# EAGLE design STM32F1_Rev0.2 (EAGLE 6.4)
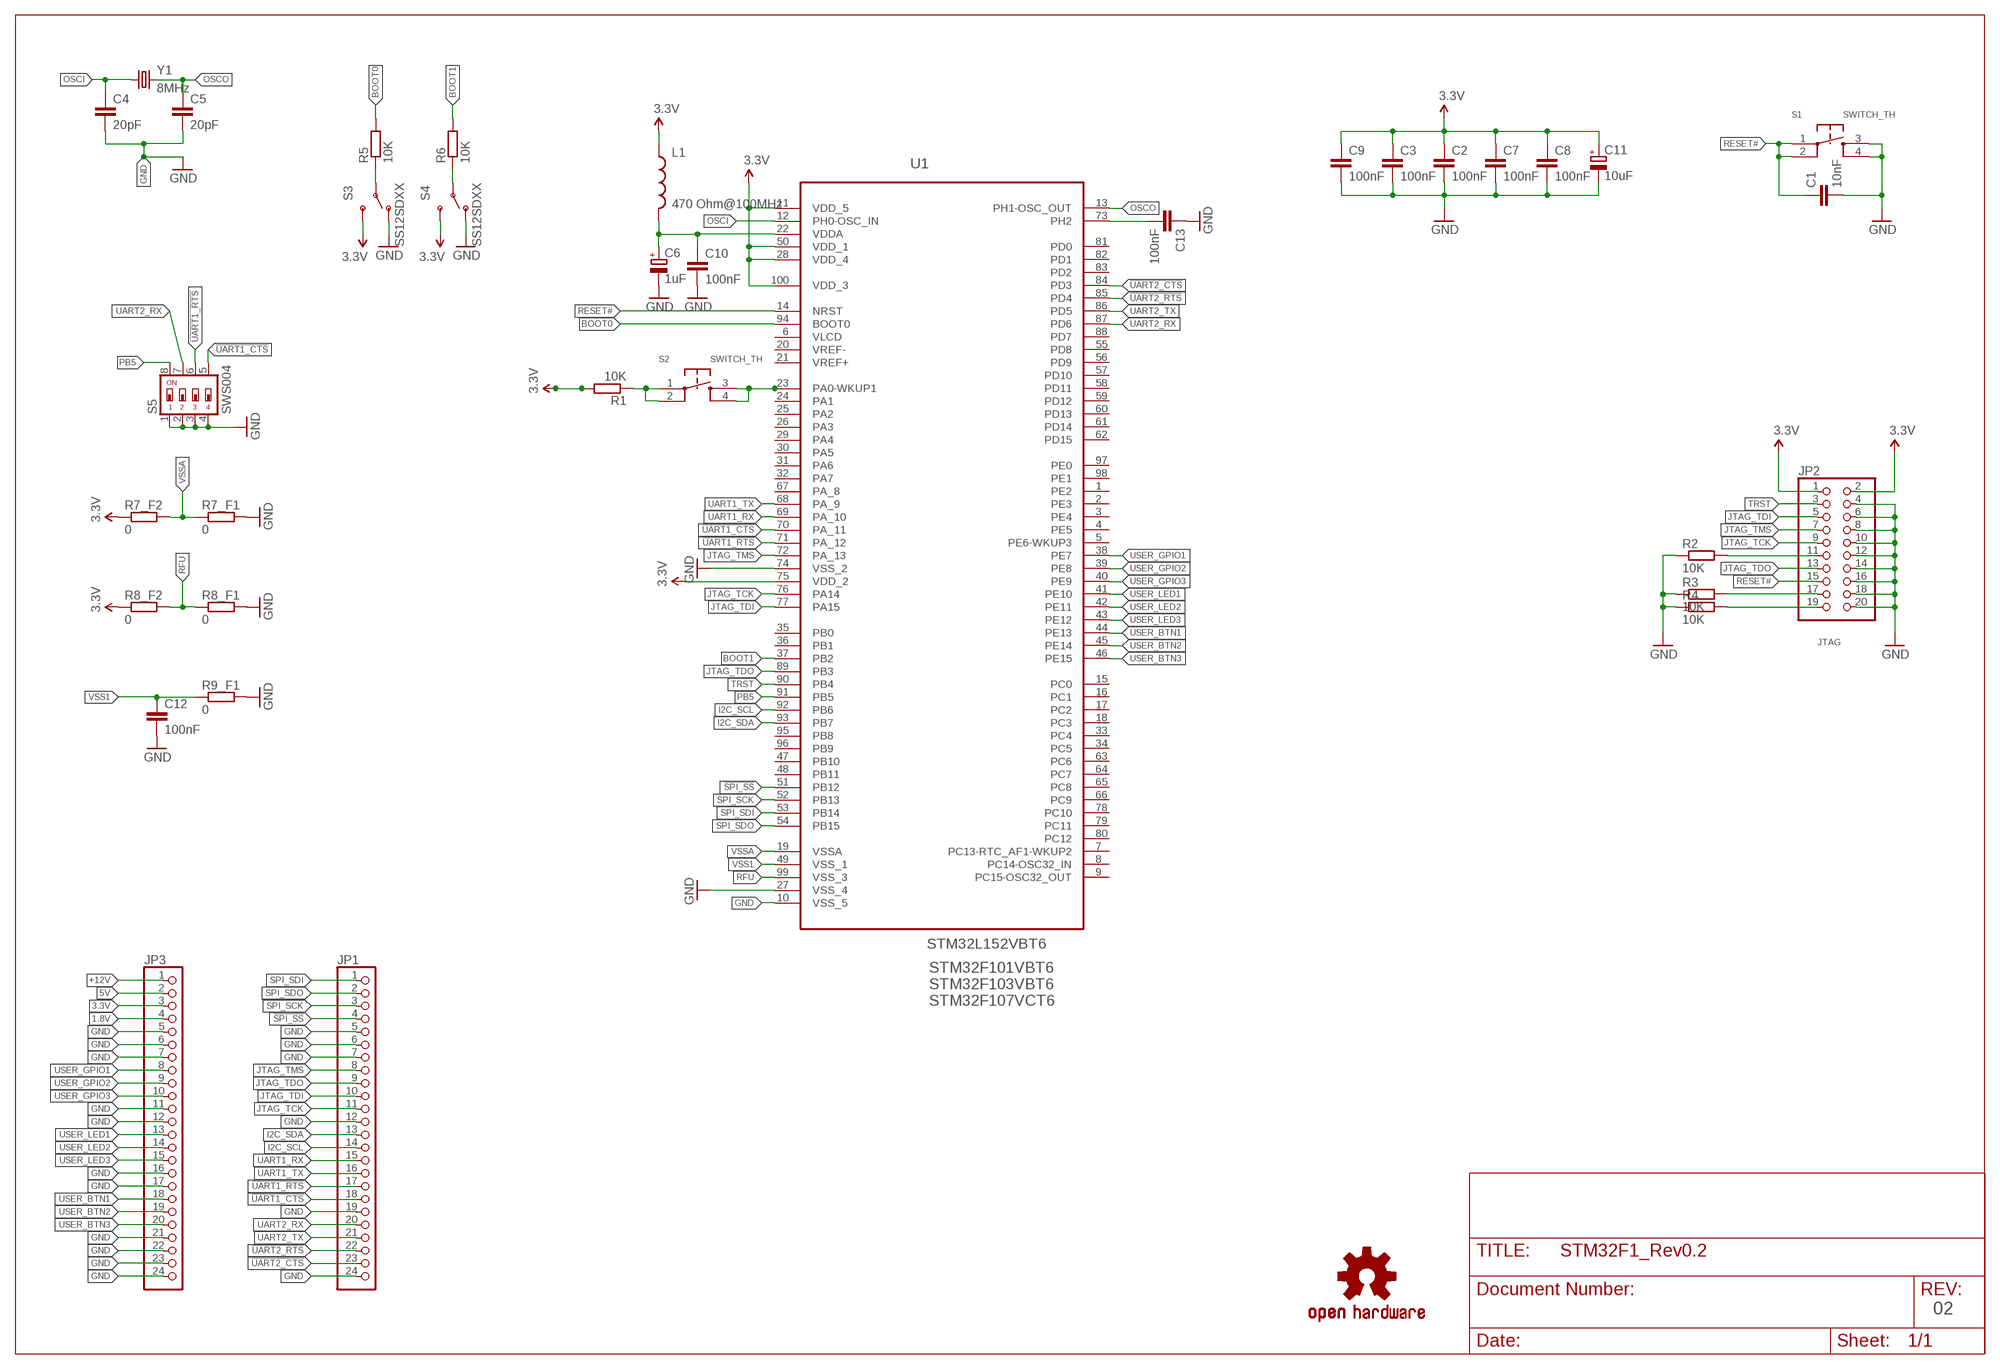
[diagram p0: schematic, sheet 1]

## Parts
C1  10nF  C-EUC0805K  [C0805K]
C2  100nF  C-EUC0805K  [C0805K]
C3  100nF  C-EUC0805K  [C0805K]
C4  20pF  C-EUC0805K  [C0805K]
C5  20pF  C-EUC0805K  [C0805K]
C6  1uF  CPOL-EUB  [PANASONIC_B]
C7  100nF  C-EUC0805K  [C0805K]
C8  100nF  C-EUC0805K  [C0805K]
C9  100nF  C-EUC0805K  [C0805K]
C10  100nF  C-EUC0805K  [C0805K]
C11  10uF  CPOL-EUB  [PANASONIC_B]
C12  100nF  C-EUC0805K  [C0805K]
C13  100nF  C-EUC0805K  [C0805K]
JP1  PINHD-1X24  [1X24]
JP2  PINHD-2X10  [2X10]
JP3  PINHD-1X24  [1X24]
L1  470 Ohm@100MHz  INDUCTOR0805  [0805]
R1  10K  R-EU_R0805  [R0805]
R2  10K  R-EU_R0805  [R0805]
R3  10K  R-EU_R0805  [R0805]
R4  10K  R-EU_R0805  [R0805]
R5  10K  R-EU_R0805  [R0805]
R6  10K  R-EU_R0805  [R0805]
R7_F1  0  R-EU_R0805  [R0805]
R7_F2  0  R-EU_R0805  [R0805]
R8_F1  0  R-EU_R0805  [R0805]
R8_F2  0  R-EU_R0805  [R0805]
R9_F1  0  R-EU_R0805  [R0805]
S1  SWITCH_TH  [SWITCH_TROUGHHOLE]
S2  SWITCH_TH  [SWITCH_TROUGHHOLE]
S3  SS12SDXX  [SS12SDXX]
S4  SS12SDXX  [SS12SDXX]
S5  SWS004  [SMS-004]
U1  STM32L152VBT6  [QFP50P1600X1600X160-100N]
U$1  OSHW-LOGOS  [OSHW-LOGO-S]
Y1  8MHz  CRYSTALSMD  [HC49UP]

## Nets
1.8V: JP3.4
3.3V: C2.1 C3.1 C7.1 C8.1 C9.1 C11.+ JP2.1 JP2.2 JP3.3 L1.1 R1.2 R7_F2.1 R8_F2.1 S3.3 S4.3 U1.11(VDD_5) U1.28(VDD_4) U1.50(VDD_1) U1.75(VDD_2) U1.100(VDD_3)
5V: JP3.2
!SPI_SS: JP1.4 U1.51(PB12)
!UART1_CTS: JP1.18 S5.5 U1.70(PA_11)
!UART1_RTS: JP1.17 S5.6 U1.71(PA_12)
!UART2_CTS: JP1.23 U1.84(PD3)
!UART2_RTS: JP1.22 U1.85(PD4)
+12V: JP3.1
BOOT0: R5.2 U1.94(BOOT0)
BOOT1: R6.2 U1.37(PB2)
GND: C1.2 C2.2 C3.2 C4.2 C5.2 C6.- C7.2 C8.2 C9.2 C10.2 C11.- C12.2 C13.1 JP1.5 JP1.6 JP1.7 JP1.12 JP1.19 JP1.24 JP2.4 JP2.6 JP2.8 JP2.10 JP2.12 JP2.14 JP2.16 JP2.18 JP2.20 JP3.5 JP3.6 JP3.7 JP3.11 JP3.12 JP3.16 JP3.17 JP3.21 JP3.22 JP3.23 JP3.24 R2.1 R3.1 R4.1 R7_F1.2 R8_F1.2 R9_F1.2 S1.3 S1.4 S3.1 S4.1 S5.1 S5.2 S5.3 S5.4 U1.10(VSS_5) U1.27(VSS_4) U1.74(VSS_2)
I2C_SCL: JP1.14 U1.92(PB6)
I2C_SDA: JP1.13 U1.93(PB7)
JTAG_TCK: JP1.11 JP2.9 U1.76(PA14)
JTAG_TDI: JP1.10 JP2.5 U1.77(PA15)
JTAG_TDO: JP1.9 JP2.13 U1.89(PB3)
JTAG_TMS: JP1.8 JP2.7 U1.72(PA_13)
N$1: C13.2 U1.73(PH2)
N$2: C6.+ C10.1 L1.2 U1.22(VDDA)
N$3: R1.1 S2.1 S2.2
N$6: R5.1 S3.2
N$7: R6.1 S4.2
N$18: JP2.11 R2.2
N$21: JP2.17 R3.2
N$22: JP2.19 R4.2
OSCI: C4.1 U1.12(PH0-OSC_IN) Y1.1
OSCO: C5.1 U1.13(PH1-OSC_OUT) Y1.2
PA0: S2.3 S2.4 U1.23(PA0-WKUP1)
PB5: S5.8 U1.91(PB5)
RESET#: C1.1 JP2.15 S1.1 S1.2 U1.14(NRST)
RFU: R8_F1.1 R8_F2.2 U1.99(VSS_3)
SPI_SCK: JP1.3 U1.52(PB13)
SPI_SDI: JP1.1 U1.53(PB14)
SPI_SDO: JP1.2 U1.54(PB15)
TRST: JP2.3 U1.90(PB4)
UART1_RX: JP1.15 U1.69(PA_10)
UART1_TX: JP1.16 U1.68(PA_9)
UART2_RX: JP1.20 S5.7 U1.87(PD6)
UART2_TX: JP1.21 U1.86(PD5)
USER_BTN1: JP3.18 U1.44(PE13)
USER_BTN2: JP3.19 U1.45(PE14)
USER_BTN3: JP3.20 U1.46(PE15)
USER_GPIO1: JP3.8 U1.38(PE7)
USER_GPIO2: JP3.9 U1.39(PE8)
USER_GPIO3: JP3.10 U1.40(PE9)
USER_LED1: JP3.13 U1.41(PE10)
USER_LED2: JP3.14 U1.42(PE11)
USER_LED3: JP3.15 U1.43(PE12)
VSS1: C12.1 R9_F1.1 U1.49(VSS_1)
VSSA: R7_F1.1 R7_F2.2 U1.19(VSSA)
Unconnected: U1.1(PE2) U1.2(PE3) U1.3(PE4) U1.4(PE5) U1.5(PE6-WKUP3) U1.7(PC13-RTC_AF1-WKUP2) U1.8(PC14-OSC32_IN) U1.9(PC15-OSC32_OUT) U1.15(PC0) U1.16(PC1) U1.17(PC2) U1.18(PC3) U1.20(VREF-) U1.21(VREF+) U1.24(PA1) U1.25(PA2) U1.26(PA3) U1.29(PA4) U1.30(PA5) U1.31(PA6) U1.32(PA7) U1.33(PC4) U1.34(PC5) U1.35(PB0) U1.36(PB1) U1.47(PB10) U1.48(PB11) U1.55(PD8) U1.56(PD9) U1.57(PD10) U1.58(PD11) U1.59(PD12) U1.60(PD13) U1.61(PD14) U1.62(PD15) U1.63(PC6) U1.64(PC7) U1.65(PC8) U1.66(PC9) U1.67(PA_8) U1.78(PC10) U1.79(PC11) U1.80(PC12) U1.81(PD0) U1.82(PD1) U1.83(PD2) U1.88(PD7) U1.95(PB8) U1.96(PB9) U1.97(PE0) U1.98(PE1)

## Notes on the sheet
- JTAG
- STM32F101VBT6
  STM32F103VBT6
  STM32F107VCT6
- 02

## Power pins joined to a net without a drawn wire
VLCD: U1.6(VLCD)

## Library data of the parts
C1-C5 C7-C10 C12 C13 = rcl:C-EU: CAPACITOR, European symbol
C6 C11 = rcl:CPOL-EU: POLARIZED CAPACITOR, European symbol
JP1 JP3 = pinhead:PINHD-1X24: PIN HEADER
JP2 = pinhead:PINHD-2X10: PIN HEADER
L1 = SparkFun:INDUCTOR: Inductors Basic Inductor/Choke - 0603 and 1206. Footprints are not proven and vary greatly between part numbers.
R1-R6 R7_F1 R7_F2 R8_F1 R8_F2 R9_F1 = rcl:R-EU_: RESISTOR, European symbol
S1 S2 = funkfinger:SWITCH_TH
S3 S4 = devboard:SS12SDXX
S5 = smd-special:SWS004: SMD Dip Switch 4 pol.
U1 = devboard:STM32L152VBT6: Ultralow power ARM-based 32-bit MCU; MPN: STM32L152VBT6; OC_FARNELL: 2060948; OC_NEWARK: 65T3809; PACKAGE: LQFP-100; SUPPLIER: STMICROELECTRONICS
U$1 = SparkFun-Aesthetics:OSHW-LOGO: Open Source Hardware Logo This logo indicates the piece of hardware it is found on incorporates a OSHW license and/or adheres to the definition of open source hardware found here: http://freedomdefined.org/OSHW
Y1 = SparkFun-FreqCtrl:CRYSTAL: Various standard crystals. Proven footprints. Spark Fun Electronics SKU : COM-00534

## Net classes
0 default: clearance 0.355 mm

## Board
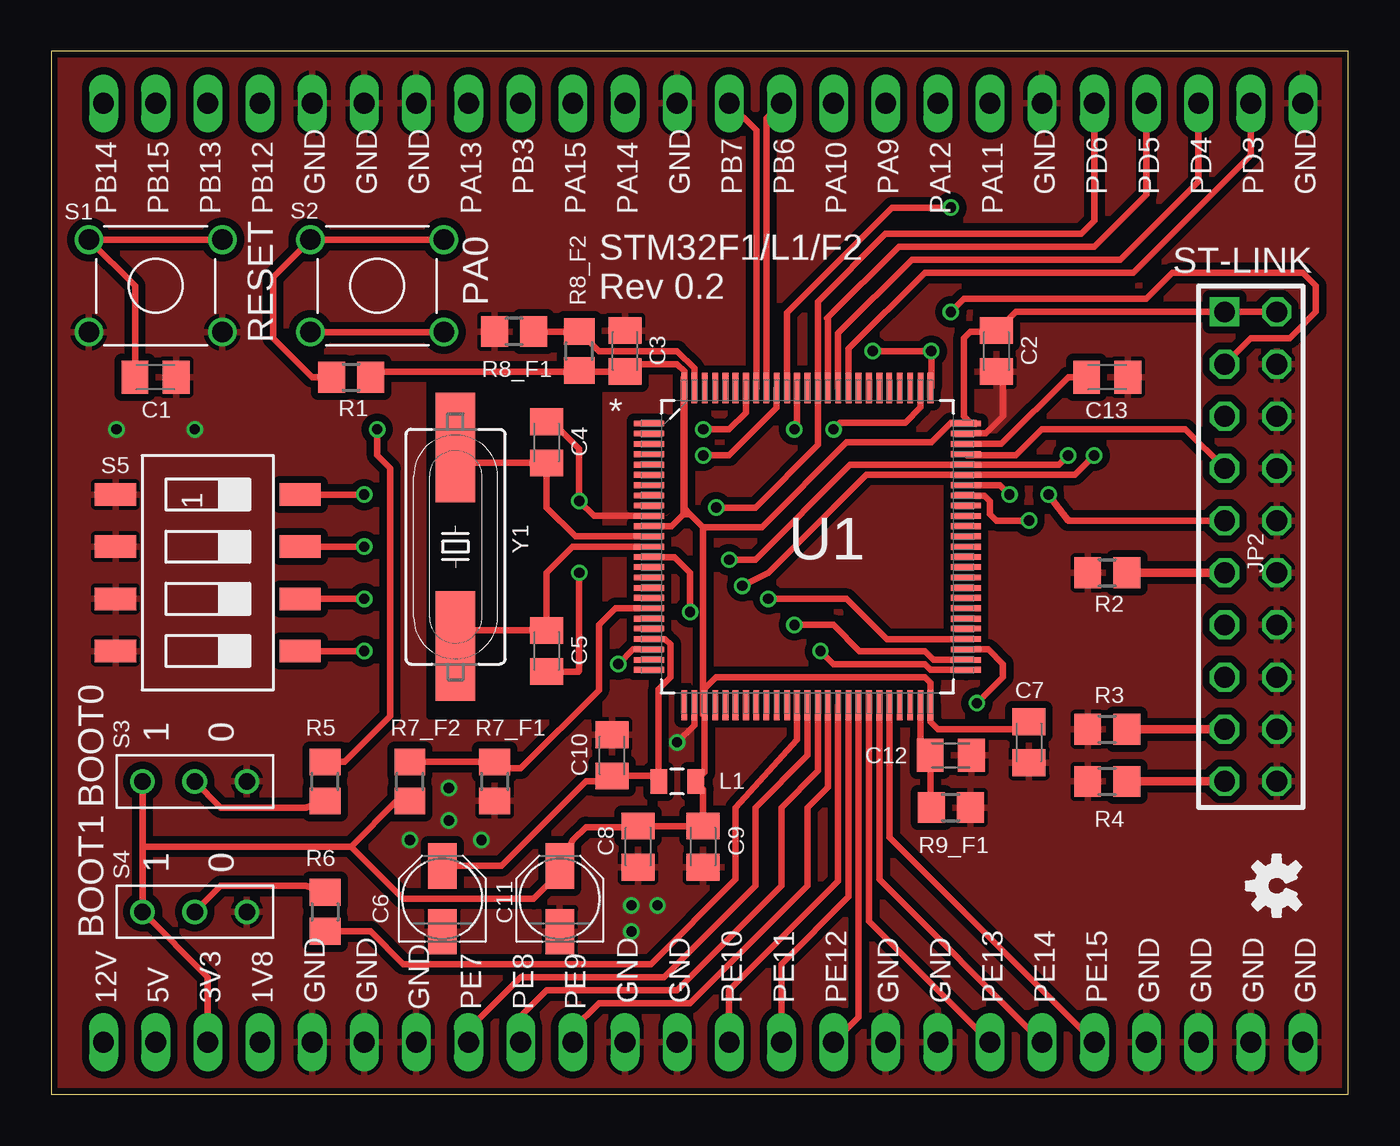
[diagram p1: board, top side]
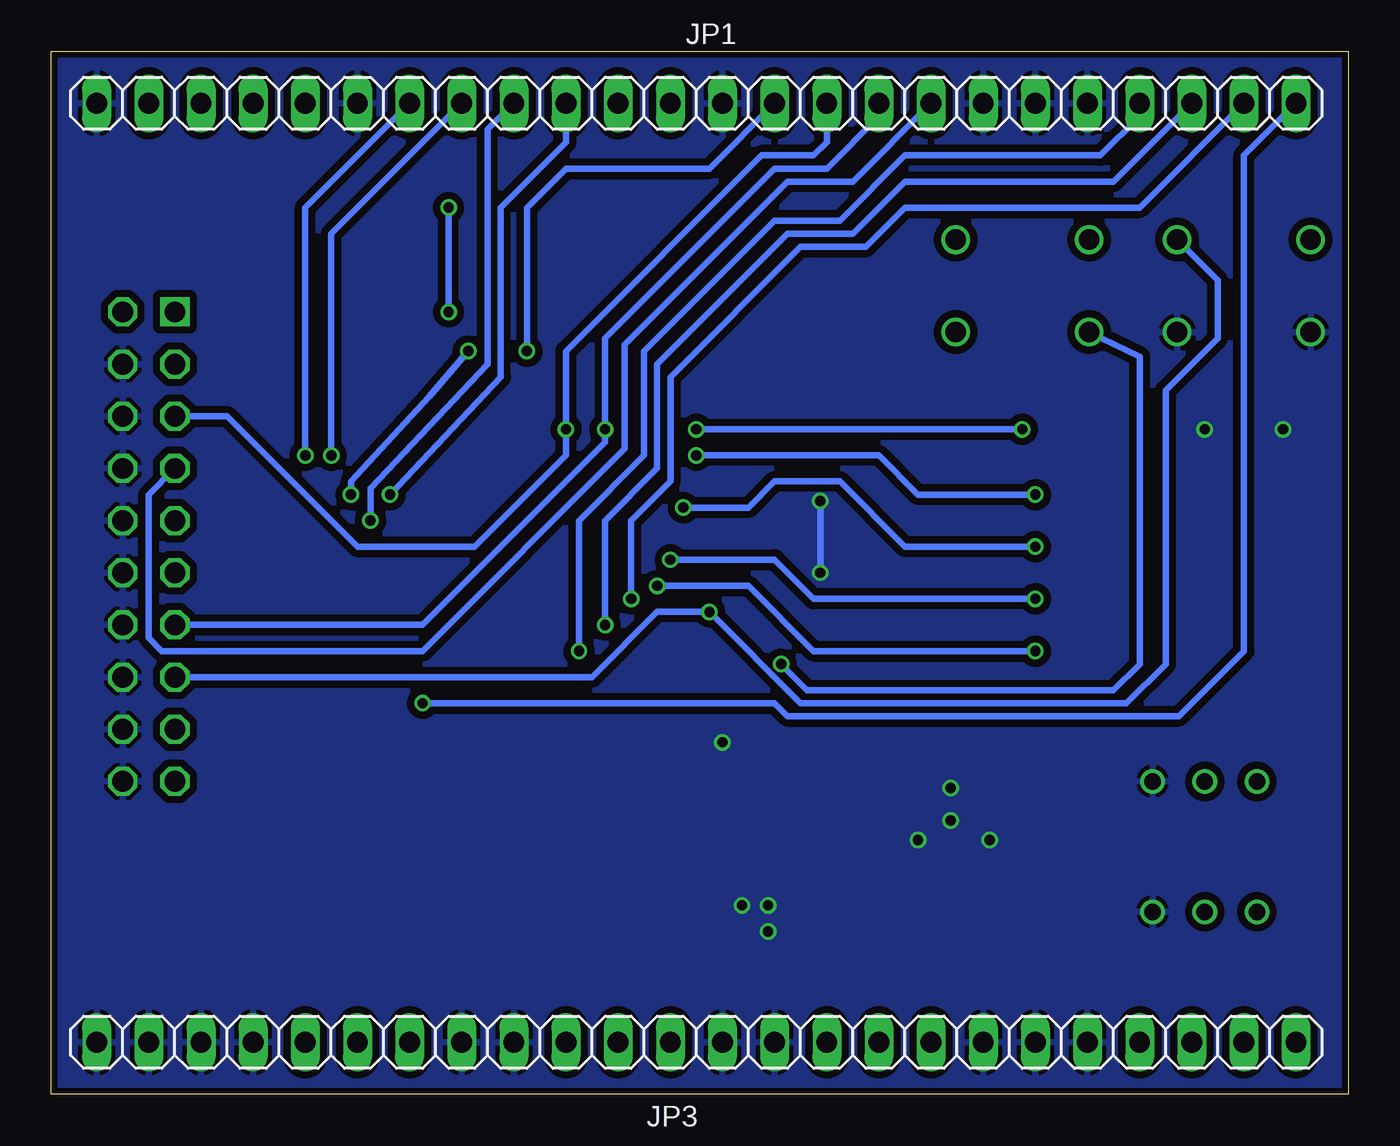
[diagram p2: board, bottom side, seen from below]

Size 63.17 x 50.79 mm. Coordinates in mm from the lower left corner, seen from the top.
Outline: 0,0 63.17,0 63.17,50.79 0,50.79 0,0
Copper layers (1*16): Top 0.035mm / dielectric 1.5mm / Bottom 0.035mm
Design rules "PCB-POOL Standard": minimum track width 0.15mm, minimum drill 0.3mm, track to track 0.15mm, track to pad 0.15mm, pad to pad 0.15mm, via to via 0.15mm, smd to smd 0.15mm, copper to edge 0.3mm, drill to drill 0.2mm, minimum pad ring 0.2mm, minimum via ring 0.15mm, stop-mask expansion 0.075mm, vias tented up to drill 0mil, thermal gap 0.2mm

### Footprints (pad centres in the part's own frame; a part is rotated, then mirrored left to right if it is on the bottom)
C0805K = smd 1.3 x 1.6: 1 -1,0; 2 1,0
PANASONIC_B = smd 2.2 x 1.4: + 1.6,0; - -1.6,0
1X24 = drill 1.016 long: 1 -29.21,0; 2 -26.67,0; 3 -24.13,0; 4 -21.59,0; 5 -19.05,0; 6 -16.51,0; 7 -13.97,0; 8 -11.43,0; 9 -8.89,0; 10 -6.35,0; 11 -3.81,0; 12 -1.27,0; 13 1.27,0; 14 3.81,0; 15 6.35,0; 16 8.89,0; 17 11.43,0; 18 13.97,0; 19 16.51,0; 20 19.05,0; 21 21.59,0; 22 24.13,0; 23 26.67,0; 24 29.21,0
2X10 = drill 1.016 square: 1 -11.43,-1.27 | drill 1.016 octagon: 2 -11.43,1.27; 3 -8.89,-1.27; 4 -8.89,1.27; 5 -6.35,-1.27; 6 -6.35,1.27; 7 -3.81,-1.27; 8 -3.81,1.27; 9 -1.27,-1.27; 10 -1.27,1.27; 11 1.27,-1.27; 12 1.27,1.27; 13 3.81,-1.27; 14 3.81,1.27; 15 6.35,-1.27; 16 6.35,1.27; 17 8.89,-1.27; 18 8.89,1.27; 19 11.43,-1.27; 20 11.43,1.27
0805 = smd 0.8 x 1.2: 1 -0.9,0; 2 0.9,0
R0805 = smd 1.3 x 1.5: 1 -0.95,0; 2 0.95,0
SWITCH_TROUGHHOLE = drill 1: 1 -3.25,2.25; 2 3.25,2.25; 3 -3.25,-2.25; 4 3.25,-2.25
SS12SDXX = drill 0.8: 1 0,2.54; 2 0,0; 3 0,-2.54
SMS-004 = smd 1.092 x 2.007: 1 -3.81,-4.496; 2 -1.27,-4.496; 3 1.27,-4.496; 4 3.81,-4.496; 5 3.81,4.496; 6 1.27,4.496; 7 -1.27,4.496; 8 -3.81,4.496
QFP50P1600X1600X160-100N = smd 1.473 x 0.279: 1 -7.722,5.994; 2 -7.722,5.512; 3 -7.722,5.004; 4 -7.722,4.496; 5 -7.722,3.988; 6 -7.722,3.505; 7 -7.722,2.997; 8 -7.722,2.489; 9 -7.722,2.007; 10 -7.722,1.499; 11 -7.722,0.991; 12 -7.722,0.508; 13 -7.722,0; 14 -7.722,-0.508; 15 -7.722,-0.991; 16 -7.722,-1.499; 17 -7.722,-2.007; 18 -7.722,-2.489; 19 -7.722,-2.997; 20 -7.722,-3.505; 21 -7.722,-3.988; 22 -7.722,-4.496; 23 -7.722,-5.004; 24 -7.722,-5.512; 25 -7.722,-5.994; 51 7.722,-5.994; 52 7.722,-5.512; 53 7.722,-5.004; 54 7.722,-4.496; 55 7.722,-3.988; 56 7.722,-3.505; 57 7.722,-2.997; 58 7.722,-2.489; 59 7.722,-2.007; 60 7.722,-1.499; 61 7.722,-0.991; 62 7.722,-0.508; 63 7.722,0; 64 7.722,0.508; 65 7.722,0.991; 66 7.722,1.499; 67 7.722,2.007; 68 7.722,2.489; 69 7.722,2.997; 70 7.722,3.505; 71 7.722,3.988; 72 7.722,4.496; 73 7.722,5.004; 74 7.722,5.512; 75 7.722,5.994 | smd 0.279 x 1.473: 26 -5.994,-7.722; 27 -5.512,-7.722; 28 -5.004,-7.722; 29 -4.496,-7.722; 30 -3.988,-7.722; 31 -3.505,-7.722; 32 -2.997,-7.722; 33 -2.489,-7.722; 34 -2.007,-7.722; 35 -1.499,-7.722; 36 -0.991,-7.722; 37 -0.508,-7.722; 38 0,-7.722; 39 0.508,-7.722; 40 0.991,-7.722; 41 1.499,-7.722; 42 2.007,-7.722; 43 2.489,-7.722; 44 2.997,-7.722; 45 3.505,-7.722; 46 3.988,-7.722; 47 4.496,-7.722; 48 5.004,-7.722; 49 5.512,-7.722; 50 5.994,-7.722; 76 5.994,7.722; 77 5.512,7.722; 78 5.004,7.722; 79 4.496,7.722; 80 3.988,7.722; 81 3.505,7.722; 82 2.997,7.722; 83 2.489,7.722; 84 2.007,7.722; 85 1.499,7.722; 86 0.991,7.722; 87 0.508,7.722; 88 0,7.722; 89 -0.508,7.722; 90 -0.991,7.722; 91 -1.499,7.722; 92 -2.007,7.722; 93 -2.489,7.722; 94 -2.997,7.722; 95 -3.505,7.722; 96 -3.988,7.722; 97 -4.496,7.722; 98 -5.004,7.722; 99 -5.512,7.722; 100 -5.994,7.722
HC49UP = smd 5.334 x 1.93: 1 -4.826,0; 2 4.826,0

### Placement (x,y rotation side)
C1  5.08,34.92 0 top
C2  46.04,36.2 270 top
C3  27.94,36.2 90 top
C4  24.13,31.75 90 top
C5  24.13,21.59 270 top
C6  19.05,9.53 90 top
C7  47.62,17.14 270 top
C8  28.57,12.06 270 top
C9  31.75,12.06 270 top
C10  27.3,16.51 90 top
C11  24.77,9.53 90 top
C12  43.81,16.51 0 top
C13  51.44,34.92 180 top
JP1  31.75,48.26 180 bottom
JP2  58.42,26.67 270 top
JP3  31.75,2.54 180 bottom
L1  30.48,15.24 180 top
R1  14.61,34.92 0 top
R2  51.44,25.4 0 top
R3  51.44,17.78 0 top
R4  51.44,15.24 0 top
R5  13.34,15.24 90 top
R6  13.34,8.89 270 top
R7_F1  21.59,15.24 270 top
R7_F2  17.46,15.24 90 top
R8_F1  22.54,37.15 180 top
R8_F2  25.72,36.2 90 top
R9_F1  43.81,13.97 0 top
S1  5.08,39.37 0 top
S2  15.88,39.37 0 top
S3  6.99,15.24 270 top
S4  6.99,8.89 270 top
S5  7.62,25.4 270 top
U1  36.83,26.67 0 top
U$1  59.69,10.16 90 top
Y1  19.68,26.67 270 top

### Tracks (layer width: path | path; a pad name or v marks a point on that pad's centre or on a via)
3.3V
  Top 0.305: U1.75 45.05,32.66 45.01,32.7 44.77,32.7 | JP3.3 7.62,5.71 S4.3 4.45,12.06 | 4.45,12.06 S3.3 | 31.83,18.41 U1.28 31.75,19.02 31.75,19.68 32.38,20.32 42.55,20.32 42.82,20.04 U1.50 42.82,18.14 43.18,17.78 47.26,17.78 C7.1 | 31.83,18.41 31.83,15.69 L1.1 31.75,14.87 C9.1 C8.1 28.53,13.02 26.04,13.02 25.41,12.39 C11.+ 24.77,10.79 23.5,9.53 17.14,9.53 14.61,12.06 | U1.100 30.84,34.92 | 28.3,35.56 30.48,35.56 30.84,35.2 30.84,34.92 | R1.2 15.82,35.2 C3.1 25.72,35.2 R8_F2.1 | R7_F2.1 16.83,14.29 14.61,12.06 | 14.61,12.06 4.45,12.06 | JP2.2 JP2.1 46.99,38.1 46.09,37.2 C2.1 45.99,37.15 44.77,37.15 44.45,36.83 44.45,33.02 44.77,32.7 | U1.11 30.2,27.66 30.8,28.26 | 30.8,28.26 30.8,34.89 30.84,34.92 | 30.8,28.26 31.11,28.26 | 31.11,28.26 31.75,27.62 | 31.75,27.62 31.75,18.49 31.83,18.41 | U1.100 30.84,33.3 | 44.77,32.7 43.81,32.7 42.86,31.75 38.73,31.75 34.61,27.62 31.75,27.62 | U1.100 30.84,28.54 31.11,28.26
  Top 0.406: C3.1 28.3,35.2 28.3,35.56
!SPI_SS  (via drill 0.5 pad 0.25)
  Top 0.305: U1.51 42.82,20.68 42.55,20.95 38.1,20.95 v37.47,21.59
  Bottom 0.305: JP1.4 10.16,47.62 12.06,45.72 21.59,45.72 24.77,42.55 27.94,42.55 34.29,36.2 34.29,31.11 37.47,27.94 v37.47,21.59
!UART1_CTS  (via drill 0.5 pad 0.25)
  Top 0.305: v50.8,31.11 49.86,30.18 U1.70 39.7,30.18 34.92,25.4 v33.66,24.77 | v15.24,21.59 S5.5
  Bottom 0.305: v50.8,31.11 50.8,43.18 JP1.18 | v33.66,24.77 29.21,24.77 26.04,21.59 v15.24,21.59
!UART1_RTS  (via drill 0.5 pad 0.25)
  Top 0.305: v49.53,31.11 49.07,30.66 U1.71 38.91,30.66 34.29,26.04 v33.02,26.04 | S5.6 v15.24,24.13
  Bottom 0.305: v49.53,31.11 49.53,41.91 JP1.17 | v15.24,24.13 26.04,24.13 27.94,26.04 v33.02,26.04
!UART2_CTS
  Top 0.305: JP1.23 58.42,45.72 52.7,40.01 42.55,40.01 38.84,36.3 U1.84
!UART2_RTS
  Top 0.305: JP1.22 55.88,44.45 52.07,40.64 41.91,40.64 38.33,37.06 U1.85
BOOT0  (via drill 0.5 pad 0.25)
  Top 0.305: U1.94 33.83,33.2 33.02,32.38 v31.75,32.38 | R5.2 14.29,16.19 16.51,18.41 16.51,30.48 15.88,31.11 v15.88,32.38
  Bottom 0.305: v31.75,32.38 v15.88,32.38
BOOT1
  Top 0.305: R6.2 15.55,7.94 17.14,6.35 29.21,6.35 33.34,10.48 33.34,13.97 36.32,17.27 U1.37
GND  (via drill 0.5 pad 0.25)
  Top 0.305: 3.17,21.54 S5.4 | 44.81,14.02 R9_F1.2 | 45.18,16.14 C12.2 | C1.2 6.13,34.92 | U1.27 31.32,17.98 v30.48,17.14 | U1.74 45.52,32.18 46.35,33.02 46.35,34.88 C2.2 | v25.72,25.4 25.72,20.64 25.67,20.59 C5.2 | 24.4,32.75 25.72,31.43 v25.72,28.89 26.44,28.17 U1.10
  Top 0.406: 24.4,32.75 C4.2
  Bottom 0.305: v25.72,25.4 v25.72,28.89
  other vias: 20.95,12.38 3.17,32.38 28.26,7.94 6.99,32.38 28.26,9.21 29.53,9.21 19.37,13.34 19.37,14.92 17.46,12.38
  pour Bottom: 0,50.8 63.5,50.8 63.5,0 0,0
  pour Top (isolate 0.305): 0,50.8 0,0 63.5,0 63.5,50.8
I2C_SCL
  Top 0.305: U1.92 34.82,47.52 JP1.14
I2C_SDA
  Top 0.305: U1.93 34.34,46.94 JP1.13
JTAG_TCK  (via drill 0.5 pad 0.25)
  Top 0.305: JP2.9 49.53,27.94 v48.58,29.21 | v40.01,36.2 v42.86,36.2 42.86,34.43 U1.76
  Bottom 0.305: v40.01,36.2 40.01,43.18 38.1,45.09 31.11,45.09 JP1.11 | v48.58,29.21 48.58,29.84 44.77,33.97 v42.86,36.2
JTAG_TDI  (via drill 0.5 pad 0.25)
  Top 0.305: U1.77 42.34,33.45 41.59,32.7 38.42,32.7 v38.1,32.38
  Bottom 0.305: JP1.10 25.4,46.35 26.04,45.72 28.57,45.72 38.1,36.2 v38.1,32.38 38.1,31.11 42.55,26.67 48.26,26.67 54.61,33.02 JP2.5
JTAG_TDO  (via drill 0.5 pad 0.25)
  Top 0.305: U1.89 36.32,32.51 v36.2,32.38
  Bottom 0.305: JP1.9 22.86,47.62 25.4,45.09 27.94,45.09 36.2,36.83 v36.2,32.38 36.2,31.75 45.09,22.86 JP2.13
JTAG_TMS
  Top 0.305: U1.72 44.6,31.11 46.99,31.11 48.26,32.38 55.24,32.38 JP2.7
  Bottom 0.305: JP1.8 24.13,44.45 27.3,44.45 35.24,36.51 35.24,31.43 45.09,21.59 57.78,21.59 58.42,22.23 58.42,29.21 JP2.7
N$1
  Top 0.305: U1.73 46.28,31.67 49.53,34.92 C13.2
N$2
  Top 0.305: U1.22 29.9,22.17 30.16,21.91 30.16,20.32 29.58,19.74 L1.2 29.31,15.51 C10.1 27.04,15.24 26.04,15.24 21.92,11.12 C6.+
N$3
  Top 0.305: R1.1 12.7,34.92 10.79,36.83 10.79,39.79 S2.1 S2.2
N$6
  Top 0.305: S3.2 8.26,13.97 12.38,13.97 R5.1
N$7
  Top 0.305: S4.2 8.26,10.16 12.38,10.16 R6.1
N$8
  cutout Top: 18.41,34.92 18.41,18.41 26.67,18.41 26.67,34.92
N$18
  Top 0.406: JP2.11 R2.2
N$21
  Top 0.406: R3.2 JP2.17
N$22
  Top 0.406: JP2.19 R4.2
OSCI
  Top 0.305: Y1.1 20.43,30.75 C4.1 24.13,28.57 25.53,27.18 U1.12
OSCO
  Top 0.305: Y1.2 20.43,22.59 C5.1 24.13,25.4 25.4,26.67 U1.13
PA0  (via drill 0.5 pad 0.25)
  Top 0.305: S2.3 S2.4 | U1.23 28.33,21.67 v27.62,20.95
  Bottom 0.305: v27.62,20.95 26.35,19.68 11.43,19.68 10.16,20.95 10.16,35.92 S2.3
PB5  (via drill 0.5 pad 0.25)
  Top 0.305: U1.91 35.33,33.43 33.02,31.11 v31.75,31.11 | v15.24,29.21 S5.8
  Bottom 0.305: v15.24,29.21 20.95,29.21 22.86,31.11 v31.75,31.11
RESET#  (via drill 0.5 pad 0.25)
  Top 0.305: C1.1 4.08,39.37 S1.1 S1.2 | U1.14 30.35,26.16 31.11,25.4 v31.11,23.5
  Bottom 0.305: JP2.15 36.83,20.32 33.66,23.5 v31.11,23.5 26.67,19.05 10.79,19.05 8.89,20.95 8.89,34.29 6.35,36.83 6.35,39.64 S1.2
RFU
  Top 0.305: U1.99 31.32,35.36 30.48,36.2 26.67,36.2 R8_F2.2 R8_F1.1
SPI_SCK  (via drill 0.5 pad 0.25)
  Top 0.305: U1.52 42.98,21.16 42.55,21.59 39.37,21.59 38.1,22.86 v36.2,22.86
  Bottom 0.305: v36.2,22.86 36.2,27.94 33.66,30.48 33.66,35.56 27.3,41.91 24.13,41.91 21.59,44.45 11.43,44.45 JP1.3
SPI_SDI  (via drill 0.5 pad 0.25)
  Top 0.305: U1.53 45.64,21.67 46.35,20.95 46.35,20.32 v45.09,19.05
  Bottom 0.305: v45.09,19.05 27.94,19.05 27.3,18.41 8.26,18.41 5.08,21.59 5.08,45.72 JP1.1
SPI_SDO  (via drill 0.5 pad 0.25)
  Top 0.305: U1.54 40.69,22.17 38.73,24.13 v34.92,24.13
  Bottom 0.305: v34.92,24.13 34.92,27.94 33.02,29.84 33.02,34.92 26.67,41.27 23.5,41.27 21.59,43.18 10.16,43.18 JP1.2
TRST  (via drill 0.5 pad 0.25)
  Top 0.305: v43.81,43.18 40.96,43.18 35.84,38.06 U1.90 | v43.81,38.1 44.45,38.73 53.34,38.73 54.61,40.01 60.96,40.01 61.59,39.37 61.59,38.1 60.33,36.83 58.42,36.83 JP2.3
  Bottom 0.305: v43.81,38.1 v43.81,43.18
UART1_RX  (via drill 0.5 pad 0.25)
  Top 0.305: U1.69 46.22,29.67 v46.67,29.21
  Bottom 0.305: v46.67,29.21 41.27,34.92 41.27,43.18 38.1,46.35 JP1.15
UART1_TX  (via drill 0.5 pad 0.25)
  Top 0.305: U1.68 45.45,29.16 45.72,28.89 45.72,28.26 46.04,27.94 v47.62,27.94
  Bottom 0.305: v47.62,27.94 47.62,29.53 41.91,35.56 41.91,46.99 JP1.16
UART2_RX  (via drill 0.5 pad 0.25)
  Top 0.305: JP1.20 50.8,42.55 50.16,41.91 40.64,41.91 37.34,38.61 U1.87 37.34,31.62 34.29,28.57 v32.38,28.57 | S5.7 v15.24,26.67
  Bottom 0.305: v15.24,26.67 21.59,26.67 24.77,29.84 27.94,29.84 29.21,28.57 v32.38,28.57
UART2_TX
  Top 0.305: JP1.21 53.34,43.81 50.8,41.27 41.27,41.27 37.78,37.78 37.82,37.74 U1.86
USER_BTN1
  Top 0.305: U1.44 39.83,8.43 JP3.18
USER_BTN2
  Top 0.305: U1.45 40.34,10.46 JP3.19
USER_BTN3
  Top 0.305: U1.46 40.82,12.52 JP3.20
USER_GPIO1
  Top 0.305: JP3.8 20.32,3.17 22.86,5.71 29.84,5.71 34.29,10.16 34.29,13.97 36.83,16.51 U1.38
USER_GPIO2
  Top 0.305: JP3.9 22.86,3.81 24.13,5.08 30.48,5.08 35.56,10.16 35.56,13.97 37.34,15.75 U1.39
USER_GPIO3
  Top 0.305: JP3.10 25.4,3.17 26.67,4.45 31.11,4.45 36.83,10.16 36.83,13.97 37.82,14.96 U1.40
USER_LED1
  Top 0.305: U1.41 38.33,10.39 33.02,5.08 JP3.13
USER_LED2
  Top 0.305: U1.42 38.84,9.63 35.56,6.35 JP3.14
USER_LED3
  Top 0.305: U1.43 39.32,3.76 JP3.15
VSS1
  Top 0.305: U1.49 42.34,16.98 C12.1 42.81,14.02 R9_F1.1
VSSA
  Top 0.305: R7_F2.2 R7_F1.1 21.91,16.19 22.23,15.88 22.86,15.88 26.67,19.68 26.67,22.86 27.48,23.67 U1.19

### Text on the board
tPlace: GND | GND | GND | PB3 | GND | PB7 | PB6 | PA9 | GND | PD6 | PD5 | PD4 | PD3 | GND | PB14 | PB15 | PB13 | RESET | PB12 | PA13 | PA15 | PA14 | PA10 | PA12 | PA11 | STM32F1/L1/F2 | ST-LINK | Rev 0.2 | PA0 | 1 | 0 | BOOT0 | 1 | 0 | BOOT1 | 12V | 5V | 3V3 | 1V8 | GND | GND | GND | PE7 | PE8 | PE9 | GND | GND | PE10 | PE11 | PE12 | GND | GND | PE13 | PE14 | PE15 | GND | GND | GND | GND